# EAGLE design cc2652r_rev_e (EAGLE 9.6.2)
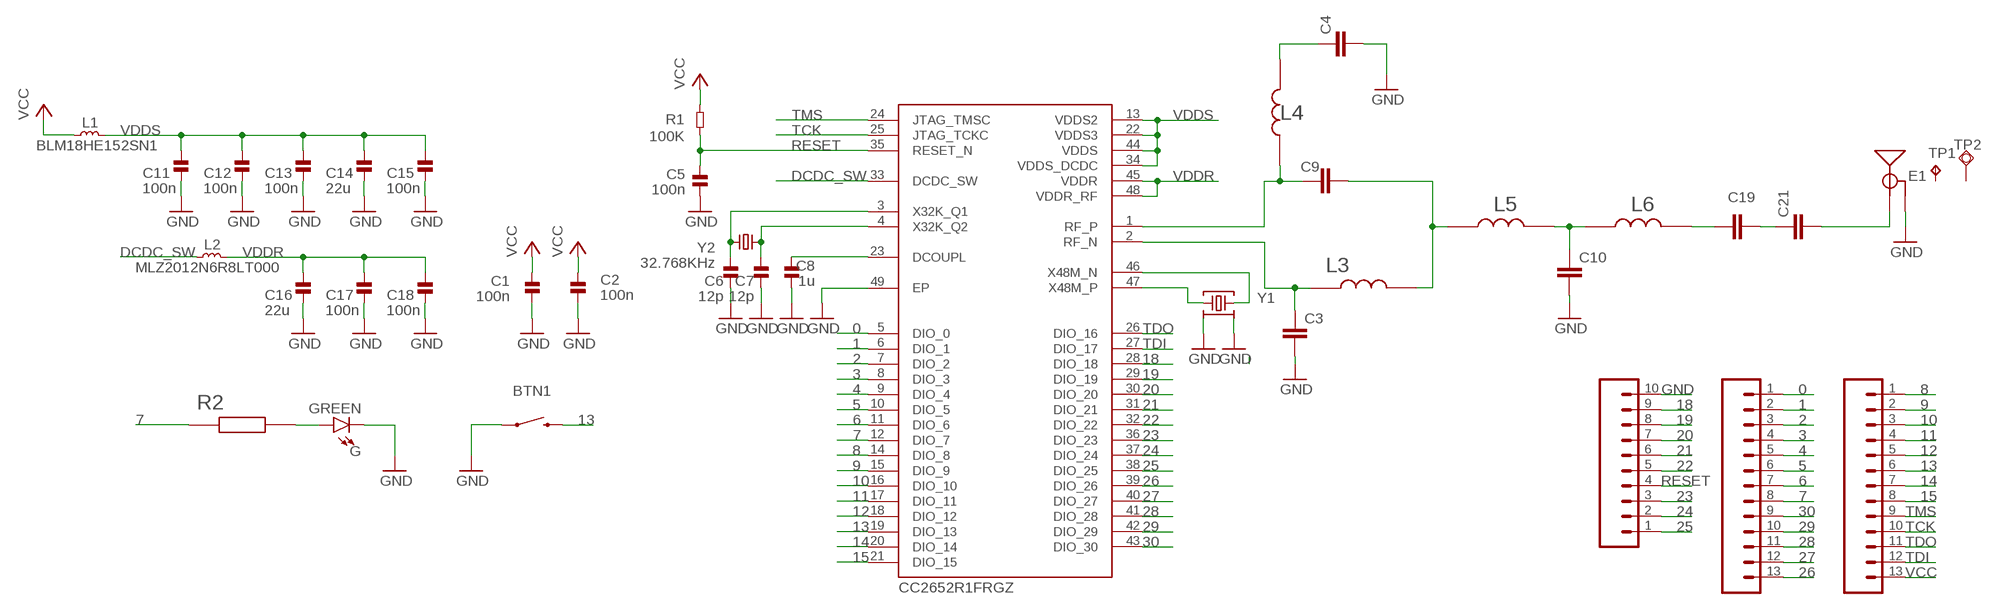
[diagram p0: schematic, sheet 1]

## Parts
BTN1  MOMENTARY-SWITCH-SPST-SMD-4.6X2.8MM  [TACTILE_SWITCH_SMD_4.6X2.8MM]
C1  100n  CAP-0402  [_PKG_C_0402]
C2  100n  CAP-0402  [_PKG_C_0402]
C3  1pF  CAP0402  [CAPC1005X40N]
C4  12pF  CAP0402  [CAPC1005X40N]
C5  100n  CAP-0402  [_PKG_C_0402]
C6  12p  CAP-0402  [_PKG_C_0402]
C7  12p  CAP-0402  [_PKG_C_0402]
C8  1u  CAP-0402  [_PKG_C_0402]
C9  1pF  CAP0402  [CAPC1005X40N]
C10  1pF  CAP0402  [CAPC1005X40N]
C11  100n  CAP-0402  [_PKG_C_0402]
C12  100n  CAP-0402  [_PKG_C_0402]
C13  100n  CAP-0402  [_PKG_C_0402]
C14  22u  CAP-0805  [_PKG_C_0805]
C15  100n  CAP-0402  [_PKG_C_0402]
C16  22u  CAP-0805  [_PKG_C_0805]
C17  100n  CAP-0402  [_PKG_C_0402]
C18  100n  CAP-0402  [_PKG_C_0402]
C19  12pF  CAP0402  [CAPC1005X40N]
C21  1.8pF  CAP0402  [CAPC1005X40N]
E1  ANTENNA-GROUNDEDTRACE-15.2MM  [TRACE_ANTENNA_2.4GHZ_15.2MM]
G  GREEN  LED-GREEN0603  [LED-0603]
IC3  CC2652R1FRGZ  WMCU-CC2652R1FRGZ  [QFN50P700X700X100-49N]
J1  CONN_051.27MM  [1X05_1.27MM]
J2  CONN_051.27MM  [1X05_1.27MM]
J3  CONN_061.27MM  [1X06_1.27MM]
L1  BLM18HE152SN1  INDUCTOR-0603  [_PKG_L_0603]
L2  MLZ2012N6R8LT000  INDUCTOR-0805  [_PKG_C_0805]
L3  2.4nH  IND0402IND0402  [INDC1005X40N]
L4  2.4nH  IND0402IND0402  [INDC1005X40N]
L5  2nH  IND0402IND0402  [INDC1005X40N]
L6  2nH  IND0402IND0402  [INDC1005X40N]
R1  100K  RES-0402  [_PKG_C_0402]
R2  2.2k  RES0402  [RESC1005X40N]
TP1  TPTP06SQ  [TP05SQ]
TP2  TPSQTP15SQ  [TP15SQ]
Y1  Q22FA12800150  48.000MHZ_CX2016DB48000C0FPLC1  [XTAL-4P-2016]
Y2  32.768KHz  32.768KHZ_Q13FC1350000400  [XTAL-2P-3215]

## Nets
0: IC3.5(DIO_0) J1.1
1: IC3.6(DIO_1) J1.2
2: IC3.7(DIO_2) J1.3
3: IC3.8(DIO_3) J1.4
4: IC3.9(DIO_4) J1.5
5: IC3.10(DIO_5) J1.6
6: IC3.11(DIO_6) J1.7
7: IC3.12(DIO_7) J1.8 R2.1
8: IC3.14(DIO_8) J2.1
9: IC3.15(DIO_9) J2.2
10: IC3.16(DIO_10) J2.3
11: IC3.17(DIO_11) J2.4
12: IC3.18(DIO_12) J2.5
13: BTN1.3 BTN1.4 IC3.19(DIO_13) J2.6
14: IC3.20(DIO_14) J2.7
15: IC3.21(DIO_15) J2.8
18: IC3.28(DIO_18) J3.9
19: IC3.29(DIO_19) J3.8
20: IC3.30(DIO_20) J3.7
21: IC3.31(DIO_21) J3.6
22: IC3.32(DIO_22) J3.5
23: IC3.36(DIO_23) J3.3
24: IC3.37(DIO_24) J3.2
25: IC3.38(DIO_25) J3.1
26: IC3.39(DIO_26) J1.13
27: IC3.40(DIO_27) J1.12
28: IC3.41(DIO_28) J1.11
29: IC3.42(DIO_29) J1.10
30: IC3.43(DIO_30) J1.9
DCDC_SW: IC3.33(DCDC_SW) L2.1
DCOUPL: C8.2 IC3.23(DCOUPL)
GND: BTN1.1 BTN1.2 C1.1 C2.1 C3.2 C4.2 C5.1 C6.1 C7.1 C8.1 C10.2 C11.2 C12.2 C13.2 C14.2 C15.2 C16.2 C17.2 C18.2 E1.GND G.C IC3.49(EP) J3.10 Y1.2 Y1.4
N$1: C9.1 IC3.1(RF_P) L4.1
N$2: C3.1 IC3.2(RF_N) L3.1
N$3: C4.1 L4.2
N$4: C9.2 L3.2 L5.1
N$5: C19.1 L6.2
N$7: G.A R2.2
N$8: C19.2 C21.1
N$9: C21.2 E1.ANT(SIGNAL)
N$10: C10.1 L5.2 L6.1
RESET: C5.2 IC3.35(RESET_N) J3.4 R1.1
TCK: IC3.25(JTAG_TCKC) J2.10
TDI: IC3.27(DIO_17) J2.12
TDO: IC3.26(DIO_16) J2.11
TMS: IC3.24(JTAG_TMSC) J2.9
VCC: C1.2 C2.2 J2.13 L1.1 R1.2
VDDR: C16.1 C17.1 C18.1 IC3.45(VDDR) IC3.48(VDDR_RF) L2.2
VDDS: C11.1 C12.1 C13.1 C14.1 C15.1 IC3.13(VDDS2) IC3.22(VDDS3) IC3.34(VDDS_DCDC) IC3.44(VDDS) L1.2
X32K_Q1: C6.2 IC3.3(X32K_Q1) Y2.1
X32K_Q2: C7.2 IC3.4(X32K_Q2) Y2.2
X48M_N: IC3.46(X48M_N) Y1.3
X48M_P: IC3.47(X48M_P) Y1.1
Unconnected: TP1.TP TP2.TP

## Library data of the parts
BTN1 = SparkFun-Switches:MOMENTARY-SWITCH-SPST: Momentary Switch (Pushbutton) - SPST Normally-open (NO) SPST momentary switches (buttons, pushbuttons). Variants PTH-12MM - 12mm square, through-hole Momentary Pushbutton Switch - 12mm Square <https://www.sparkfun.com/products/9190> (COM-09190) PTH-6.0MM, PTH-6.0MM-KIT - 6.0mm square, through-hole Mini Pushbutton Switch <https://www.sparkfun.com/products/97> (COM-00097) KIT package intended for soldering kit's - only one side of pads' copper is exposed. PTH-RIGHT-ANGLE-KIT - Right-angle, through-hole Right Angle Tactile Button <https://www.sparkfun.com/products/10791> - Used on SparkFun BigTime Watch Kit <https://www.sparkfun.com/products/11734> SMD-12MM - 12mm square, surface-mount Tactile Button - SMD (12mm) <https://www.sparkfun.com/products/12993> (COM-12993) Used on SparkFun PicoBoard <https://www.sparkfun.com/products/11888> SMD-4.5MM - 4.5mm Square Trackball Switch Used on SparkFun Blackberry Trackballer Breakout <https://www.sparkfun.com/products/13169> SMD-4.6MMX2.8MM - 4.60mm x 2.80mm, surface mount Used on SparkFun SAMD21 Mini Breakout <https://www.sparkfun.com/products/13664> SMD-5.2MM, SMD-5.2-REDUNDANT - 5.2mm square, surface-mount Mini Pushbutton Switch - SMD <https://www.sparkfun.com/products/8720> (COM-08720) Used on Arduino Pro Mini <https://www.sparkfun.com/products/11114> REDUNDANT package connects both switch circuits together SMD-6.0X3.5MM - 6.0 x 3.5mm, surface mount Momentary Reset Switch SMD <https://www.sparkfun.com/products/8229> (COM-08229) SMD-6.2MM-TALL - 6.2mm square, surface mount Tactile Button - SMD (6mm) <https://www.sparkfun.com/products/12992> Used on SparkFun Digital Sandbox <https://www.sparkfun.com/products/12651> SMD-RIGHT-ANGLE - Right-angle, surface mount Used on SparkFun Block for Intel® Edison - Arduino <https://www.sparkfun.com/products/13036>; PROD_ID: SWCH-13065
C1 C2 C5-C8 C11-C18 = ok-discretes-dev:CAP
C3 C4 C9 C10 C19 C21 = discretes-dev:CAP0402: CAP, 0402; AVAILABILITY: Good; DESCRIPTION: RESISTOR, 0402 0.063W 1% 3M6; Resistance:3.6Mohm; Resistance Tolerance:± 1%; Power Rating:0.063W; Voltage Rating:50V; Series:RC32H; Temperature Coefficient:± 100ppm/°C; Resistor Element Type:Thick Film; Resistor Case Style:0402; No. of Pins:2; SVHC:No SVHC; Case Style:0402; External Length / Height:1mm; Temperature Coeff. +:100ppm/°C; Temperature Coeff. -:100ppm/°C; External Depth:0.35mm; External Width:0.5mm; Operating Temperature Range:-55°C to +155°C; Overload Voltage:100V; MF: Yageo; MP: RC0402FR-073M6L; PACKAGE: 1005 Panasonic Electronic Components; PRICE: None; PURCHASE-URL: https://pricing.snapeda.com/search/part/RC0402FR-073M6L/?ref=eda
E1 = SparkFun-RF:ANTENNA-GROUNDED: Antenna w/ Ground Connection 2.4GHz antennae with signal and ground terminals. TRACE_ANTENNA_2.4GHZ_15.2MM - Meander Trace antenna 15.2 x 5.7mm footprint Based on layout from TI app note AN043 <http://www.ti.com/lit/an/swra117d/swra117d.pdf>. TRACE_ANTENNA_2.4GHZ_25.7MM - Inverted F trace antenna 25.7 x 7.5 mm footprint. Based on layout from TI design note DN0007 <http://www.ti.com/lit/an/swru120b/swru120b.pdf>.
G = SparkFun-LED:LED-GREEN: Green SMD LED Used in manufacturing of various products at SparkFun Packages: 0603 - SMD 0603 package [Product Link] <http://www.futureelectronics.com/en/technologies/semiconductors/optoelectronics/leds/Pages/9894312-LTST-C190GKT.aspx?CrossPart=HSMG-C190&IM=0> LilyPad 1206 - SMD1206 LilyPad package [Product Link] <http://www.futureelectronics.com/en/Technologies/Product.aspx?ProductID=IN150NGHARVATEKCORPORATION2049943&IM=0> 1206 - SMD1206 package [Product Link] <http://www.futureelectronics.com/en/technologies/semiconductors/optoelectronics/leds/Pages/8315665-LTST-C150KGKT.aspx?IM=0> 1206 Bottom Mount -SMD 1206 Bottom Mount [Product Link] <http://www.digikey.com/product-detail/en/lite-on-inc/LTST-C230KGKT/160-1456-1-ND/386854> SparkFun Products: Pro Mini 328 -5V <https://www.sparkfun.com/products/821> RedBoard <https://www.sparkfun.com/products/12757> MP3 Trigger <https://www.sparkfun.com/products/13720> Makey Makey <https://www.sparkfun.com/products/11076>; PROD_ID: DIO-00821
IC3 = ok-chips-dev:WMCU-CC2652R1FRGZ: Texas Instruments SimpleLink? Multi-Standard CC2652R Wireless MCU 48-VQFN -40 to 85 Source: Datasheet <http://www.ti.com/lit/ds/symlink/cc2652r.pdf>; DESCRIPTION: Texas Instruments SimpleLink? Multi-Standard CC2652R Wireless MCU 48-VQFN -40 to 85; HEIGHT: 1mm; MANUFACTURER_NAME: Texas Instruments; MANUFACTURER_PART_NUMBER: CC2652R1FRGZT; MOUSER_PART_NUMBER: 595-CC2652R1FRGZT; MOUSER_PRICE-STOCK: https://www.mouser.com/Search/Refine.aspx?Keyword=595-CC2652R1FRGZT
J1 J2 = SparkFun-Connectors:CONN_05: Multi connection point. Often used as Generic Header-pin footprint for 0.1 inch spaced/style header connections On any of the 0.1 inch spaced packages, you can populate with these: Break Away Headers - Straight <https://www.sparkfun.com/products/116> (PRT-00116) Break Away Male Headers - Right Angle <https://www.sparkfun.com/products/553> (PRT-00553) Female Headers <https://www.sparkfun.com/products/115> (PRT-00115) Break Away Headers - Machine Pin <https://www.sparkfun.com/products/117> (PRT-00117) Break Away Female Headers - Swiss Machine Pin <https://www.sparkfun.com/products/743> (PRT-00743) For SCREWTERMINALS and SPRING TERMINALS visit here: Screw Terimnals on SparkFun.com <https://www.sparkfun.com/search/results?term=Screw+Terminals> (5mm/3.5mm/2.54mm spacing) This device is also useful as a general connection point to wire up your design to another part of your project. Our various solder wires solder well into these plated through hole pads. Hook-Up Wire - Assortment (Stranded, 22 AWG) <https://www.sparkfun.com/products/11375> (PRT-11375) Hook-Up Wire - Assortment (Solid Core, 22 AWG) <https://www.sparkfun.com/products/11367> (PRT-11367) View the entire wire category on our website here <https://www.sparkfun.com/categories/141> Special notes: Molex polarized connector foot print use with SKU : PRT-08231 with associated crimp pins and housings. 1MM SMD Version SKU: PRT-10208
J3 = SparkFun-Connectors:CONN_06: Multi connection point. Often used as Generic Header-pin footprint for 0.1 inch spaced/style header connections On any of the 0.1 inch spaced packages, you can populate with these: Break Away Headers - Straight <https://www.sparkfun.com/products/116> (PRT-00116) Break Away Male Headers - Right Angle <https://www.sparkfun.com/products/553> (PRT-00553) Female Headers <https://www.sparkfun.com/products/115> (PRT-00115) Break Away Headers - Machine Pin <https://www.sparkfun.com/products/117> (PRT-00117) Break Away Female Headers - Swiss Machine Pin <https://www.sparkfun.com/products/743> (PRT-00743) Arduino Stackable Header - 6 Pin <https://www.sparkfun.com/products/9280> (PRT-09280) For SCREWTERMINALS and SPRING TERMINALS visit here: Screw Terimnals on SparkFun.com <https://www.sparkfun.com/search/results?term=Screw+Terminals> (5mm/3.5mm/2.54mm spacing) This device is also useful as a general connection point to wire up your design to another part of your project. Our various solder wires solder well into these plated through hole pads. Hook-Up Wire - Assortment (Stranded, 22 AWG) <https://www.sparkfun.com/products/11375> (PRT-11375) Hook-Up Wire - Assortment (Solid Core, 22 AWG) <https://www.sparkfun.com/products/11367> (PRT-11367) View the entire wire category on our website here <https://www.sparkfun.com/categories/141>
L1 L2 = ok-discretes-dev:INDUCTOR
L3-L6 = discretes-dev:IND0402: RESISTOR, 0402 0.063W 1% 3M6; Resistance:3.6Mohm; Resistance Tolerance:± 1%; Power Rating:0.063W; Voltage Rating:50V; Series:RC32H; Temperature Coefficient:± 100ppm/°C; Resistor Element Type:Thick Film; Resistor Case Style:0402; No. of Pins:2; SVHC:No SVHC; Case Style:0402; External Length / Height:1mm; Temperature Coeff. +:100ppm/°C; Temperature Coeff. -:100ppm/°C; External Depth:0.35mm; External Width:0.5mm; Operating Temperature Range:-55°C to +155°C; Overload Voltage:100V Check prices <https://pricing.snapeda.com/parts/RC0402FR-073M6L/Yageo/view-part?ref=eda>; AVAILABILITY: Good; DESCRIPTION: RESISTOR, 0402 0.063W 1% 3M6; Resistance:3.6Mohm; Resistance Tolerance:± 1%; Power Rating:0.063W; Voltage Rating:50V; Series:RC32H; Temperature Coefficient:± 100ppm/°C; Resistor Element Type:Thick Film; Resistor Case Style:0402; No. of Pins:2; SVHC:No SVHC; Case Style:0402; External Length / Height:1mm; Temperature Coeff. +:100ppm/°C; Temperature Coeff. -:100ppm/°C; External Depth:0.35mm; External Width:0.5mm; Operating Temperature Range:-55°C to +155°C; Overload Voltage:100V; MF: Yageo; MP: RC0402FR-073M6L; PACKAGE: 1005 Panasonic Electronic Components; PRICE: None; PURCHASE-URL: https://pricing.snapeda.com/search/part/RC0402FR-073M6L/?ref=eda
R1 = ok-discretes-dev:RES
R2 = discretes-dev:RES0402: RESISTOR, 0402 0.063W 1% 3M6; Resistance:3.6Mohm; Resistance Tolerance:± 1%; Power Rating:0.063W; Voltage Rating:50V; Series:RC32H; Temperature Coefficient:± 100ppm/°C; Resistor Element Type:Thick Film; Resistor Case Style:0402; No. of Pins:2; SVHC:No SVHC; Case Style:0402; External Length / Height:1mm; Temperature Coeff. +:100ppm/°C; Temperature Coeff. -:100ppm/°C; External Depth:0.35mm; External Width:0.5mm; Operating Temperature Range:-55°C to +155°C; Overload Voltage:100V Check prices <https://pricing.snapeda.com/parts/RC0402FR-073M6L/Yageo/view-part?ref=eda>; AVAILABILITY: Good; DESCRIPTION: RESISTOR, 0402 0.063W 1% 3M6; Resistance:3.6Mohm; Resistance Tolerance:± 1%; Power Rating:0.063W; Voltage Rating:50V; Series:RC32H; Temperature Coefficient:± 100ppm/°C; Resistor Element Type:Thick Film; Resistor Case Style:0402; No. of Pins:2; SVHC:No SVHC; Case Style:0402; External Length / Height:1mm; Temperature Coeff. +:100ppm/°C; Temperature Coeff. -:100ppm/°C; External Depth:0.35mm; External Width:0.5mm; Operating Temperature Range:-55°C to +155°C; Overload Voltage:100V; MF: Yageo; MP: RC0402FR-073M6L; PACKAGE: 1005 Panasonic Electronic Components; PRICE: None; PURCHASE-URL: https://pricing.snapeda.com/search/part/RC0402FR-073M6L/?ref=eda
TP1 = testpad:TP: Test pad
TP2 = testpad:TPSQ: Test pad
Y1 = ok-xtal-osc-dev:48.000MHZ_CX2016DB48000C0FPLC1: 48MHz ±10ppm Crystal 7pF 50 Ohms 4-SMD, No Lead Datasheet <https://media.digikey.com/pdf/Data%20Sheets/Kyocera%20International/CX2016DB48000C0FPLC1_DS.pdf>; DIGIKEY_PART: 1253-2042-1-ND; MFG_NAME: KYOCERA; MFG_PART: CX2016DB48000C0FPLC1
Y2 = ok-xtal-osc-dev:32.768KHZ_Q13FC1350000400: SMD Crystal Resonators 32.768KHz +/-20ppm SMD-3215_2P RoHS Datasheet <https://datasheet.lcsc.com/szlcsc/1901081604_Seiko-Epson-Q13FC1350000400_C32346.pdf>; LCSC_PART: C32346; MFG_NAME: SEIKO EPSON; MFG_PART: Q13FC1350000400

## Board
cc2652r Revision E
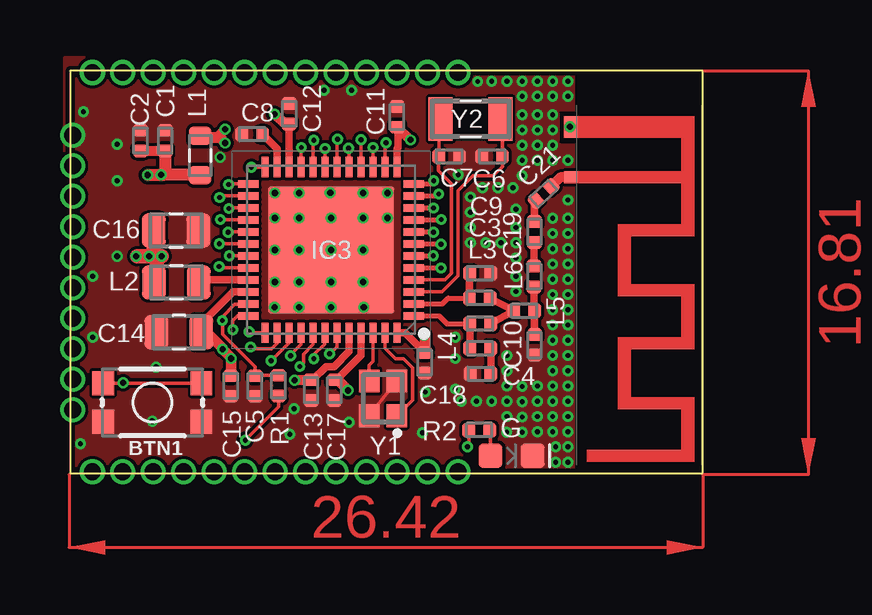
[diagram p1: board, top side]
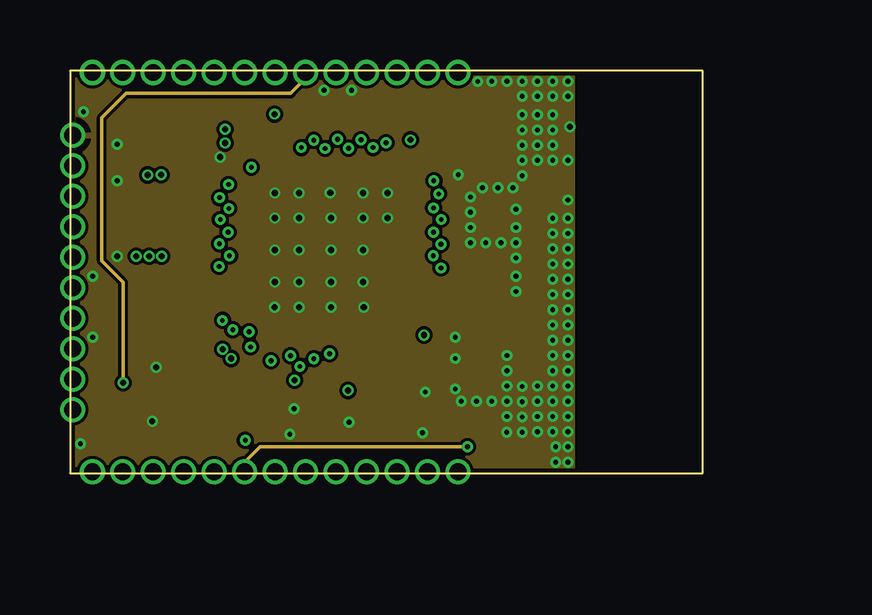
[diagram p2: board, inner layer Route2]
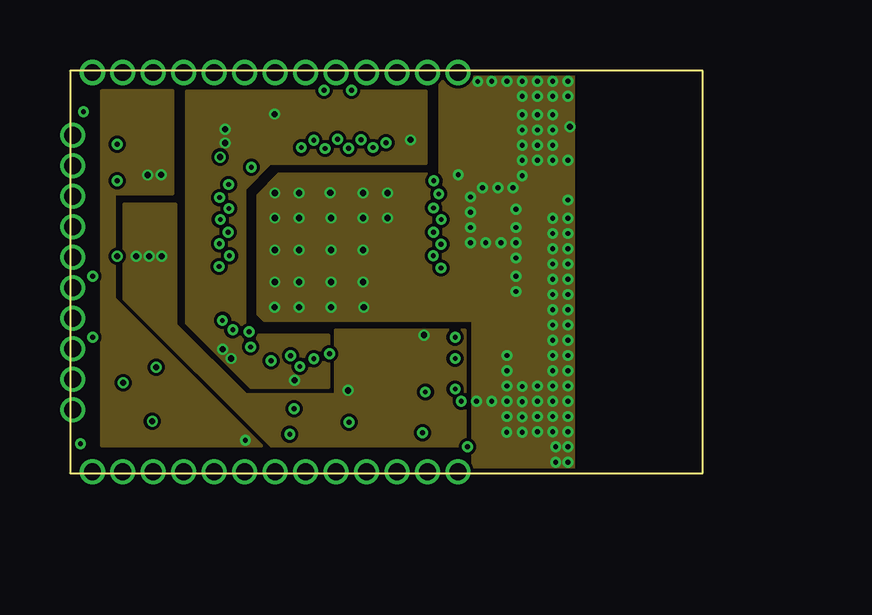
[diagram p3: board, inner layer Route15]
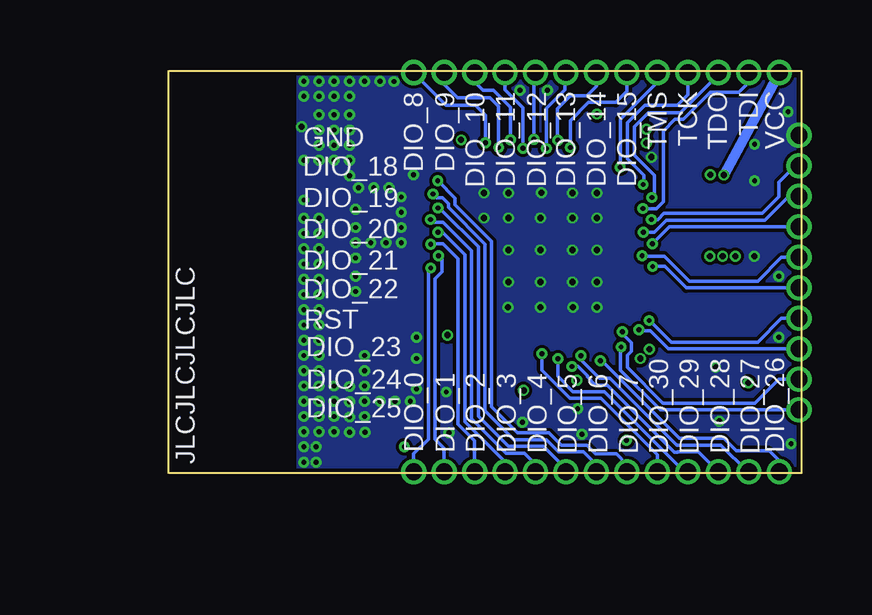
[diagram p4: board, bottom side, seen from below]

Size 26.38 x 16.76 mm. Coordinates in mm from the lower left corner, seen from the top.
Outline: 0,0 26.38,0 26.38,16.76 0,16.76 0,0
Copper layers (1*2*15*16): Top 0.035559375mm / dielectric 0.17018125mm / Route2 0.01778125mm / dielectric 0.4mm / Route15 0.01778125mm / dielectric 0.17018125mm / Bottom 0.035559375mm
Design rules "oshpark-4layer *": minimum track width 6mil, minimum drill 0.2mm, track to track 5mil, track to pad 5mil, pad to pad 5mil, via to via 5mil, smd to smd 5mil, copper to edge 0.16mm, drill to drill 0.2mm, minimum pad ring 4mil, minimum via ring 4mil, stop-mask expansion 2.5mil, vias tented up to drill 50mil, thermal gap 10mil
tRestrict: area 20.4,13.8 to 21,15; area 16,13.9 to 17.4,15.6

### Footprints (pad centres in the part's own frame; a part is rotated, then mirrored left to right if it is on the bottom)
TACTILE_SWITCH_SMD_4.6X2.8MM = smd 0.9 x 1: 1 -2.05,-0.8; 2 2.05,-0.8; 3 2.05,0.8; 4 -2.05,0.8
_PKG_C_0402 = smd 0.54 x 0.6: 1 -0.43,0; 2 0.43,0
CAPC1005X40N = smd 0.54 x 0.6: 1 -0.432,0; 2 0.432,0
_PKG_C_0805 = smd 1 x 1.42: 1 -0.935,0; 2 0.935,0
TRACE_ANTENNA_2.4GHZ_15.2MM = smd 0.5 x 0.5: ANT 0,-0.25 | smd 0.9 x 0.5: GND -2.1,-0.25
LED-0603 = smd 1 x 1: A -0.877,0; C 0.877,0
QFN50P700X700X100-49N = smd 0.85 x 0.3: 1 -3.45,2.75; 2 -3.45,2.25; 3 -3.45,1.75; 4 -3.45,1.25; 5 -3.45,0.75; 6 -3.45,0.25; 7 -3.45,-0.25; 8 -3.45,-0.75; 9 -3.45,-1.25; 10 -3.45,-1.75; 11 -3.45,-2.25; 12 -3.45,-2.75; 25 3.45,-2.75; 26 3.45,-2.25; 27 3.45,-1.75; 28 3.45,-1.25; 29 3.45,-0.75; 30 3.45,-0.25; 31 3.45,0.25; 32 3.45,0.75; 33 3.45,1.25; 34 3.45,1.75; 35 3.45,2.25; 36 3.45,2.75 | smd 0.3 x 0.85: 13 -2.75,-3.45; 14 -2.25,-3.45; 15 -1.75,-3.45; 16 -1.25,-3.45; 17 -0.75,-3.45; 18 -0.25,-3.45; 19 0.25,-3.45; 20 0.75,-3.45; 21 1.25,-3.45; 22 1.75,-3.45; 23 2.25,-3.45; 24 2.75,-3.45; 37 2.75,3.45; 38 2.25,3.45; 39 1.75,3.45; 40 1.25,3.45; 41 0.75,3.45; 42 0.25,3.45; 43 -0.25,3.45; 44 -0.75,3.45; 45 -1.25,3.45; 46 -1.75,3.45; 47 -2.25,3.45; 48 -2.75,3.45 | smd 5.25 x 5.25: 49 0,0
1X05_1.27MM = drill 0.7 pad 1: 1 0,0; 2 1.27,0; 3 2.54,0; 4 3.81,0; 5 5.08,0; 6 6.35,0; 7 7.62,0; 8 8.89,0; 9 10.16,0; 10 11.43,0; 11 12.7,0; 12 13.97,0; 13 15.24,0
1X06_1.27MM = drill 0.7 pad 1: 1 0,0; 2 1.27,0; 3 2.54,0; 4 3.81,0; 5 5.08,0; 6 6.35,0; 7 7.62,0; 8 8.89,0; 9 10.16,0; 10 11.43,0
_PKG_L_0603 = smd 0.79 x 0.93: 1 -0.82,0; 2 0.82,0
INDC1005X40N = smd 0.54 x 0.6: 1 -0.432,0; 2 0.432,0
RESC1005X40N = smd 0.54 x 0.6: 1 -0.432,0; 2 0.432,0
TP05SQ = smd 0.5 x 0.5: TP 0,0
TP15SQ = smd 0.5 x 0.9: TP 0,0
XTAL-4P-2016 = smd 0.95 x 0.85: 1 -0.725,-0.575; 2 0.725,-0.575; 3 0.725,0.575; 4 -0.725,0.575
XTAL-2P-3215 = smd 1 x 1.8: 1 -1.25,0; 2 1.25,0

### Placement (x,y rotation side)
BTN1  3.43,2.95 0 top
C1  3.96,13.86 270 top
C2  2.93,13.86 270 top
C3  17.09,8.32 0 top
C4  17.11,4.14 180 top
C5  7.71,3.63 90 top
C6  17.59,13.2 0 top
C7  15.8,13.2 180 top
C8  7.59,14.12 0 top
C9  17.09,6.22 0 top
C10  19.37,5.35 270 top
C11  13.63,14.85 90 top
C12  9.13,14.97 90 top
C13  10.05,3.45 270 top
C14  4.53,5.87 180 top
C15  6.69,3.63 270 top
C16  4.42,10.11 0 top
C17  11.01,3.45 270 top
C18  14.78,4.6 270 top
C19  19.35,10.05 90 top
C21  19.74,11.65 42.5 top
E1  21.11,12.32 270 top
G  18.4,0.72 0 top
IC3  10.88,9.3 180 top
J1  16.17,0.05 180 top
J2  16.17,16.69 180 top
J3  0.1,2.64 90 top
L1  5.42,13.23 90 top
L2  4.43,7.95 180 top
L3  17.08,7.29 0 top
L4  17.09,5.19 0 top
L5  18.94,6.76 0 top
L6  19.34,8.19 90 top
R1  8.69,3.64 270 top
R2  17.06,1.79 0 top
TP1  20.85,12.32 0 top
TP2  20.85,14.41 0 top
Y1  13.04,3.11 90 top
Y2  16.7,14.76 180 top

### Tracks (layer width: path | path; a pad name or v marks a point on that pad's centre or on a via)
0  (via drill 0.2 pad 0.45)
  Top 0.2: IC3.5 v15.45,8.55 v15.46,8.55
  Bottom 0.152: J1.1 16.17,0.8 15.56,1.41 15.56,8.45 v15.46,8.55
1  (via drill 0.2 pad 0.45)
  Top 0.2: IC3.6 v15.13,9.05 v15.14,9.06
  Bottom 0.152: 15.11,9.06 v15.14,9.06 15.01,9.06 14.99,9.03 14.99,8.38 15.28,8.09 15.28,1.41 14.9,1.03 J1.2
2  (via drill 0.2 pad 0.45)
  Top 0.2: IC3.7 v15.46,9.55 v15.46,9.54
  Bottom 0.152: v15.46,9.54 15.43,9.56 14.95,9.56 14.33,8.94 14.33,2.05 13.63,1.35 J1.3
3  (via drill 0.2 pad 0.45)
  Top 0.2: IC3.8 15.14,10.05 v15.15,10.03
  Bottom 0.152: v15.15,10.03 15.14,10.05 14.97,10.05 14.03,9.11 14.03,2.15 12.36,0.47 J1.4
4  (via drill 0.2 pad 0.45)
  Top 0.2: IC3.9 15.45,10.55 v15.47,10.57
  Bottom 0.152: v15.47,10.57 15.36,10.46 14.95,10.46 13.75,9.26 13.75,2.26 12.32,0.83 11.54,0.83 11.09,0.37 J1.5
5  (via drill 0.2 pad 0.45)
  Top 0.2: IC3.10 v15.15,11.05
  Bottom 0.152: v15.15,11.05 15.04,10.94 14.98,10.94 13.47,9.43 13.47,2.38 12.21,1.12 10.76,1.12 9.82,0.18 J1.6
6  (via drill 0.2 pad 0.45)
  Top 0.2: IC3.11 15.28,11.55 v15.37,11.63
  Bottom 0.152: J1.7 8.55,0.34 9.09,0.89 10.13,0.89 10.64,1.4 11.99,1.4 13.2,2.6 13.2,9.54 14.72,11.07 14.72,11.23 14.97,11.48 15.21,11.48 v15.37,11.63
7  (via drill 0.2 pad 0.45)
  Top 0.152: R2.1 16.62,1.16 v16.56,1.09
  Top 0.2: IC3.12 15.03,12.05 v15.16,12.18
  Route2 0.152: v16.56,1.09 7.92,1.09 7.28,0.44 J1.8
  Bottom 0.152: v15.16,12.18 | 15.14,12.18 v15.16,12.18 | J1.8 7.28,0.36 7.72,0.8 8.58,0.8 8.95,1.17 10.02,1.17 10.53,1.68 11.84,1.68 12.92,2.76 12.92,9.66 14.44,11.19 14.44,11.46 v15.16,12.18
8  (via drill 0.2 pad 0.45)
  Top 0.152: IC3.14 13.13,13.77 v13.17,13.77
  Bottom 0.152: v13.17,13.77 13.17,14.91 13.59,15.33 14.82,15.33 16.17,16.68 J2.1
9  (via drill 0.2 pad 0.45)
  Top 0.152: IC3.15 v12.63,13.55 v12.62,13.56
  Bottom 0.152: 12.61,13.57 v12.62,13.56 12.62,15.29 12.98,15.65 14.34,15.65 14.9,16.21 J2.2
10  (via drill 0.2 pad 0.45)
  Top 0.152: IC3.16 v12.13,13.89
  Bottom 0.152: v12.13,13.89 12.13,15.24 12.84,15.95 13.27,15.95 13.63,16.31 J2.3
11  (via drill 0.2 pad 0.45)
  Top 0.152: IC3.17 11.63,13.51 v11.61,13.54
  Bottom 0.152: v11.61,13.54 11.66,13.59 11.61,13.64 11.61,15.21 12.36,15.96 J2.4
12  (via drill 0.2 pad 0.45)
  Top 0.152: IC3.18 11.13,13.89 v11.15,13.91
  Bottom 0.152: J2.5 11.15,16.62 v11.15,13.91
13  (via drill 0.2 pad 0.45, 0.25)
  Top 0.152: IC3.19 v10.63,13.52 v10.63,13.53 | BTN1.3 5.47,3.76 5.45,3.75 2.22,3.75 v2.21,3.76 2.2,3.75 BTN1.4 1.54,3.75 1.43,3.85
  Route2 0.152: v2.21,3.76 2.21,7.95 1.32,8.84 1.32,14.81 2.34,15.82 9.19,15.82 9.82,16.45 9.82,16.49 J2.6
  Bottom 0.152: v10.63,13.53 10.63,15.2 9.87,15.96 9.87,16.64 J2.6
14  (via drill 0.2 pad 0.45)
  Top 0.152: IC3.20 10.13,13.84 v10.16,13.87
  Bottom 0.152: v10.16,13.87 10.19,13.89 10.19,15.18 9.64,15.72 8.95,15.72 8.55,16.13 J2.7
15  (via drill 0.2 pad 0.45)
  Top 0.152: IC3.21 v9.63,13.56 v9.64,13.56
  Bottom 0.152: v9.64,13.56 9.64,14.68 8.88,15.44 7.75,15.44 7.28,15.91 J2.8
18  (via drill 0.2 pad 0.45)
  Top 0.152: IC3.28 6.28,10.55 v6.26,10.57
  Bottom 0.152: v6.26,10.57 6,10.57 5.74,10.82 1.64,10.82 0.94,11.52 0.94,12.13 0.27,12.8 J3.9
19  (via drill 0.2 pad 0.45)
  Top 0.152: IC3.29 6.6,10.05 v6.59,10.03
  Bottom 0.152: 6.58,10.05 v6.59,10.03 6.14,10.03 5.63,10.54 1.52,10.54 0.53,11.53 J3.8
20  (via drill 0.2 pad 0.45)
  Top 0.152: IC3.30 v6.23,9.55 v6.22,9.55
  Bottom 0.152: v6.22,9.55 5.51,10.26 J3.7
21  (via drill 0.2 pad 0.45)
  Top 0.152: IC3.31 v6.65,9.05 v6.64,9.06
  Bottom 0.152: v6.64,9.06 6.63,9.04 5.72,9.04 4.68,8 1.83,8 0.84,8.99 J3.6
22  (via drill 0.2 pad 0.45)
  Top 0.152: IC3.32 6.27,8.55 v6.21,8.61
  Bottom 0.152: v6.21,8.61 5.69,8.61 4.8,7.72 J3.5
23  (via drill 0.2 pad 0.45)
  Top 0.152: IC3.36 6.98,6.55 6.78,6.35 v6.78,5.97
  Bottom 0.152: J3.3 5.55,5.18 6.3,5.93 6.75,5.93 v6.78,5.97
24  (via drill 0.2 pad 0.45)
  Top 0.152: 8.03,5.74 IC3.37 7.51,5.85 v7.47,5.89
  Bottom 0.152: J3.2 0.95,3.91 1.94,2.92 5.77,2.92 7.26,4.41 7.26,4.91 7.09,5.08 7.09,5.44 7.47,5.81 v7.47,5.89
25  (via drill 0.2 pad 0.45)
  Top 0.152: IC3.38 8.63,5.41 8.41,5.18 7.59,5.18 v7.52,5.26
  Bottom 0.152: v7.52,5.26 7.52,5.25 7.54,5.22 7.54,4.3 5.89,2.64 2.08,2.64 1.98,2.64 J3.1
26  (via drill 0.2 pad 0.45)
  Top 0.152: v8.38,4.69 9.13,5.44 IC3.39
  Bottom 0.152: J1.13 0.93,0.51 1.35,0.93 2.72,0.93 3.24,1.45 5.09,1.45 8.33,4.69 v8.38,4.69
27  (via drill 0.2 pad 0.45)
  Top 0.152: IC3.40 9.63,5.38 9.19,4.94 v9.19,4.89
  Bottom 0.152: v9.19,4.89 9.19,4.72 8.42,3.95 7.99,3.95 5.2,1.17 3.35,1.17 2.23,0.05 J1.12
28  (via drill 0.2 pad 0.45)
  Top 0.152: IC3.41 10.13,5.36 9.73,4.96 9.73,4.6 v9.58,4.45
  Bottom 0.152: v9.58,4.45 9.32,4.45 8.93,4.05 8.93,4.01 8.58,3.67 8.1,3.67 5.29,0.86 5.18,0.86 5.16,0.89 4.3,0.89 J1.11
29  (via drill 0.2 pad 0.45)
  Top 0.152: v10.16,4.76 10.14,4.79 10.14,4.91 10.6,5.37 IC3.42
  Bottom 0.152: v10.16,4.76 10.16,4.03 9.52,3.39 8.22,3.39 4.88,0.05 J1.10
30  (via drill 0.2 pad 0.45)
  Top 0.152: IC3.43 11.13,5.27 10.8,4.94 10.79,4.95 v10.82,4.98
  Bottom 0.152: v10.81,4.98 v10.82,4.98 10.82,4.28 9.65,3.11 8.36,3.11 6.01,0.76 J1.9
DCDC_SW
  Top 0.305: IC3.33 5.46,8.05 L2.1
DCOUPL
  Top 0.305: IC3.23 8.63,13.51 C8.2
GND  (via drill 0.2 pad 0.45, 0.25, 0.25 pad 0.46)
  Top 0.152: v20.84,14.43 E1.GND 20.74,14.3 | Y1.4 Y1.2
  other vias: 12.22,10.63 10.88,9.3 9.55,10.63 10.88,10.63 12.22,9.3 12.22,7.96 10.88,7.96 9.55,7.96 9.55,9.3 16.18,12.43 6.26,13.17 9.33,2.68 14.81,3.38 9.55,11.67 10.85,11.68 12.22,11.67 9.54,6.91 10.88,6.91 12.24,6.91 19.48,1.73 20.12,1.73 20.12,2.36 20.12,3 20.12,3.63 20.12,4.27 20.12,4.9 20.12,5.54 20.12,6.17 20.12,6.81 20.12,7.44 20.12,8.08 20.12,8.71 20.12,9.35 20.12,9.98 20.12,10.62 20.12,13.03 19.48,13.03 19.48,13.67 20.12,13.67 20.12,14.3 19.48,14.3 19.48,14.94 20.12,14.94 19.48,15.7 20.12,15.7 18.85,1.7 18.2,1.7 18.21,2.36 3.43,2.16 3.58,4.41 1.97,9.03 20.75,1.09 20.75,0.46 20.24,1.09 20.24,0.46 20.75,2.36 20.75,1.73 20.75,3 20.75,3.63 20.75,4.27 20.75,4.9 20.75,5.54 20.75,6.17 20.75,6.81 20.75,7.44 20.75,8.08 20.75,8.71 20.75,9.35 20.75,9.98 20.75,10.62 20.75,11.38 20.75,13.03 20.75,15.7 20.75,16.33 20.12,16.33 19.48,16.33 18.85,16.33 18.21,16.33 17.58,16.33 16.99,16.32 18.85,13.03 18.85,12.4 18.47,11.89 17.83,11.89 17.2,11.89 16.69,11.51 16.69,10.87 16.69,10.24 16.69,9.6 17.32,9.6 17.96,9.6 18.59,9.6 18.59,8.97 18.59,8.2 18.59,7.57 18.59,10.24 18.59,11 18.21,4.9 18.21,4.27 18.21,3.63 18.21,3 17.58,3 16.94,3 16.31,3 16.05,5.66 16.05,4.78 16.05,3.51 18.85,15.7 18.85,14.94 18.85,14.3 18.85,13.67 0.56,15.06 0.43,1.22 0.94,8.2 0.94,5.66 11.73,15.95 10.59,15.95 1.96,13.7 1.96,12.18 11.63,2.12 9.16,1.61 14.69,1.68 18.85,2.34 19.48,2.36 18.85,2.97 19.48,3 18.85,3.61 19.48,3.63 8.53,11.67 8.53,10.63 8.53,9.3 8.53,7.96 8.52,6.91 13.23,11.67 13.23,10.63
  pour Top (no thermals): -0.23,17.31 -0.23,-0.53 20.98,-0.53 20.98,17.31
  pour Route15: 7.84,11.58 7.84,6.63 8.09,6.38 16.8,6.38 16.8,-0.01 20.99,-0.01 20.99,16.75 15.42,16.75 15.42,12.45 8.7,12.45
  pour Route2: 20.99,17.09 -0.16,17.09 -0.16,-0.37 20.99,-0.37
  pour Bottom (no thermals): -0.11,17.21 -0.11,-0.54 20.98,-0.54 20.98,17.21
N$1
  Top 0.203: IC3.1 15.39,6.55 15.71,6.22 C9.1
  Top 0.305: C9.1 L4.1
N$2
  Top 0.203: IC3.2 15.52,7.05 15.76,7.29 L3.1
  Top 0.305: L3.1 16.65,7.41 | 16.69,7.33 L3.1 | L3.1 16.65,8.31 C3.1
N$3
  Top 0.305: L4.2 17.54,5.18 C4.1
N$4
  Top 0.305: L3.2 L5.1 C9.2
N$5
  Top 0.305: L6.2 19.34,9.6 C19.1
N$7
  Top 0.152: R2.2 17.53,1.75 G.A
N$8
  Top 0.305: C21.1 19.35,11.29 C19.2
N$9
  Top 0.406: E1.ANT 20.44,12.32 C21.2
N$10
  Top 0.305: L5.2 19.38,6.74 | L5.2 19.34,6.78 L6.1 | C10.1 | L5.2 C10.1
RESET  (via drill 0.2 pad 0.45)
  Top 0.152: R1.1 7.72,4.08 | 7.72,4.08 C5.2 | IC3.35 7.41,7.03 6.86,7.03 6.35,6.52 v6.35,6.36 6.35,5.8 7.72,4.42 7.72,4.08
  Bottom 0.152: J3.4 0.84,6.45 1.83,5.46 5.43,5.46 6.19,6.21 6.2,6.21 v6.35,6.36
TCK  (via drill 0.2 pad 0.45)
  Top 0.152: IC3.25 6.62,12.05 v6.6,12.03
  Bottom 0.152: v6.6,12.03 6.57,12.07 6.57,12.41 7.26,13.11 7.26,14.59 6.53,15.33 5.18,15.33 4.74,15.77 J2.10
TDI  (via drill 0.2 pad 0.45)
  Top 0.152: IC3.27 6.64,11.05 v6.62,11.02
  Bottom 0.152: 6.59,11.05 v6.62,11.02 6.04,11.02 5.77,11.3 5.77,14.25 5.27,14.74 4.93,14.74 3.81,15.86 2.62,15.86 2.2,16.28 | J2.12 2.2,16.28 | 2.2,16.28 2.2,16.23
TDO  (via drill 0.2 pad 0.45)
  Top 0.152: IC3.26 7.42,11.56 6.31,11.56 v6.24,11.48
  Bottom 0.152: v6.24,11.48 6.14,11.58 6.14,12.41 6.97,13.25 6.97,14.44 6.39,15.02 5.04,15.02 3.47,16.6 J2.11
TMS  (via drill 0.2 pad 0.45)
  Top 0.152: IC3.24 v7.56,12.75 v7.56,12.74
  Bottom 0.152: v7.56,12.74 7.56,14.74 6.01,16.29 J2.9
VCC  (via drill 0.2 pad 0.45, 0.25 pad 0.46)
  Top 0.152: v7.3,1.37 8.69,2.76 R1.2
  Top 0.406: C2.2 C1.2 | 3.96,12.5 3.89,12.42 | v3.8,12.43 3.73,12.43 3.72,12.42
  Top 0.508: L1.1 5.4,12.44 v3.8,12.44 v3.8,12.43 | 3.89,12.42 3.72,12.42 v3.24,12.42 | C1.2 3.96,12.5
  Bottom 0.406: 3.2,12.46 v3.24,12.42 J2.13 0.95,16.69
  pour Route15: 4.28,15.93 4.28,11.65 1.83,11.65 1.83,7.28 7.98,1.13 1.32,1.13 1.32,15.93
VDDR  (via drill 0.25, 0.25 pad 0.46)
  Top 0.152: v2.76,9.04 3.6,9.04
  Top 0.305: IC3.45 12.13,4.91 11.11,3.88 C17.1 11.14,3.88 | IC3.48 13.96,5.85 C18.1
  Top 0.406: v14.76,5.75 14.78,5.73 C18.1
  Top 0.432: 11.14,3.88 v11.58,3.44
  Top 0.61: 3.34,9.97 C16.1 3.48,9.04 v3.29,9.04 | L2.2 3.61,8.06 3.61,9.06 3.6,9.04 v3.82,9.04 | v3.29,9.04 2.79,9.04 | v3.29,9.04 3.3,9.06
  pour Route15: 11.07,5.96 11.07,3.26 7.33,3.26 4.41,6.18 4.41,11.2 2.26,11.2 2.26,7.25 8.37,1.14 16.47,1.14 16.47,5.96
VDDS  (via drill 0.25, 0.25 pad 0.45, 0.25 pad 0.46)
  Top 0.152: 5.57,13.91 L1.2
  Top 0.254: 5.47,6.22 C14.1
  Top 0.305: L1.2 6.19,14.05 | IC3.34 6.8,7.55 5.47,6.22 | C14.1 5.68,5.87 | 6.72,4.09 C15.1 | IC3.44 11.63,5.07 11,4.43 10.66,4.43 10.12,3.88 C13.1 | v9.36,3.87 9.37,3.88 | IC3.13 13.63,13.52 13.67,13.56 13.67,14.37 C11.1 | IC3.22 C12.1
  Top 0.33: 6.31,13.91 5.57,13.91
  Top 0.406: v6.46,14.33 6.19,14.05 | v6.46,13.75 6.31,13.91 | 9.37,3.88 C13.1 | C11.1 14.16,13.88 v14.19,13.88 | C12.1 8.95,14.54 8.53,14.96 v8.52,14.96
  Top 0.432: 5.68,5.87 6.35,5.2 v6.35,5.17 6.72,4.8 v6.72,4.78 6.72,4.09
  pour Route15: 10.78,3.58 7.52,3.58 4.85,6.25 4.85,15.91 14.83,15.91 14.83,12.92 8.34,12.92 7.26,11.84 7.26,5.74 10.78,5.74
X32K_Q1
  Top 0.152: 14.63,7.55 IC3.3 15.51,7.55 16.18,8.21 16.18,11.76 16.8,12.38 17.63,12.38 18.02,12.77 C6.2 18.02,14.69 Y2.1
X32K_Q2
  Top 0.152: IC3.4 14.35,8.06 15.63,8.06 15.9,8.33 15.9,12.07 15.37,12.6 C7.2 15.37,14.68 Y2.2
X48M_N
  Top 0.152: 12.61,5.82 IC3.46 12.63,4.66 12.47,4.49 Y1.3 12.27,3.64
X48M_P
  Top 0.152: IC3.47 13.13,5.21 13.56,4.78 13.89,4.78 14.27,4.39 14.27,3.04 Y1.1
(copper drawn outside any net)
  shapes: Top area x2

### Text on the board
tNames: G
bNames: VCC | TDI | TDO | TCK | TMS | DIO_15 | DIO_14 | DIO_13 | DIO_12 | DIO_11 | DIO_10 | DIO_9 | DIO_8 | GND | DIO_18 | DIO_19 | DIO_20 | DIO_21 | DIO_22 | RST | DIO_23 | DIO_24 | DIO_25 | DIO_26 | DIO_27 | DIO_28 | DIO_29 | DIO_30 | DIO_7 | DIO_6 | DIO_5 | DIO_4 | DIO_3 | DIO_2 | DIO_1 | DIO_0 | JLCJLCJLCJLC